# Altium schematic sheet Microcontroller_IO.SchDoc: Microcontroller IO Ports
size A4; DrawnBy: J. Wilson & M. Small; Revision: 1.0; SheetNumber: 2; SheetTotal: 10
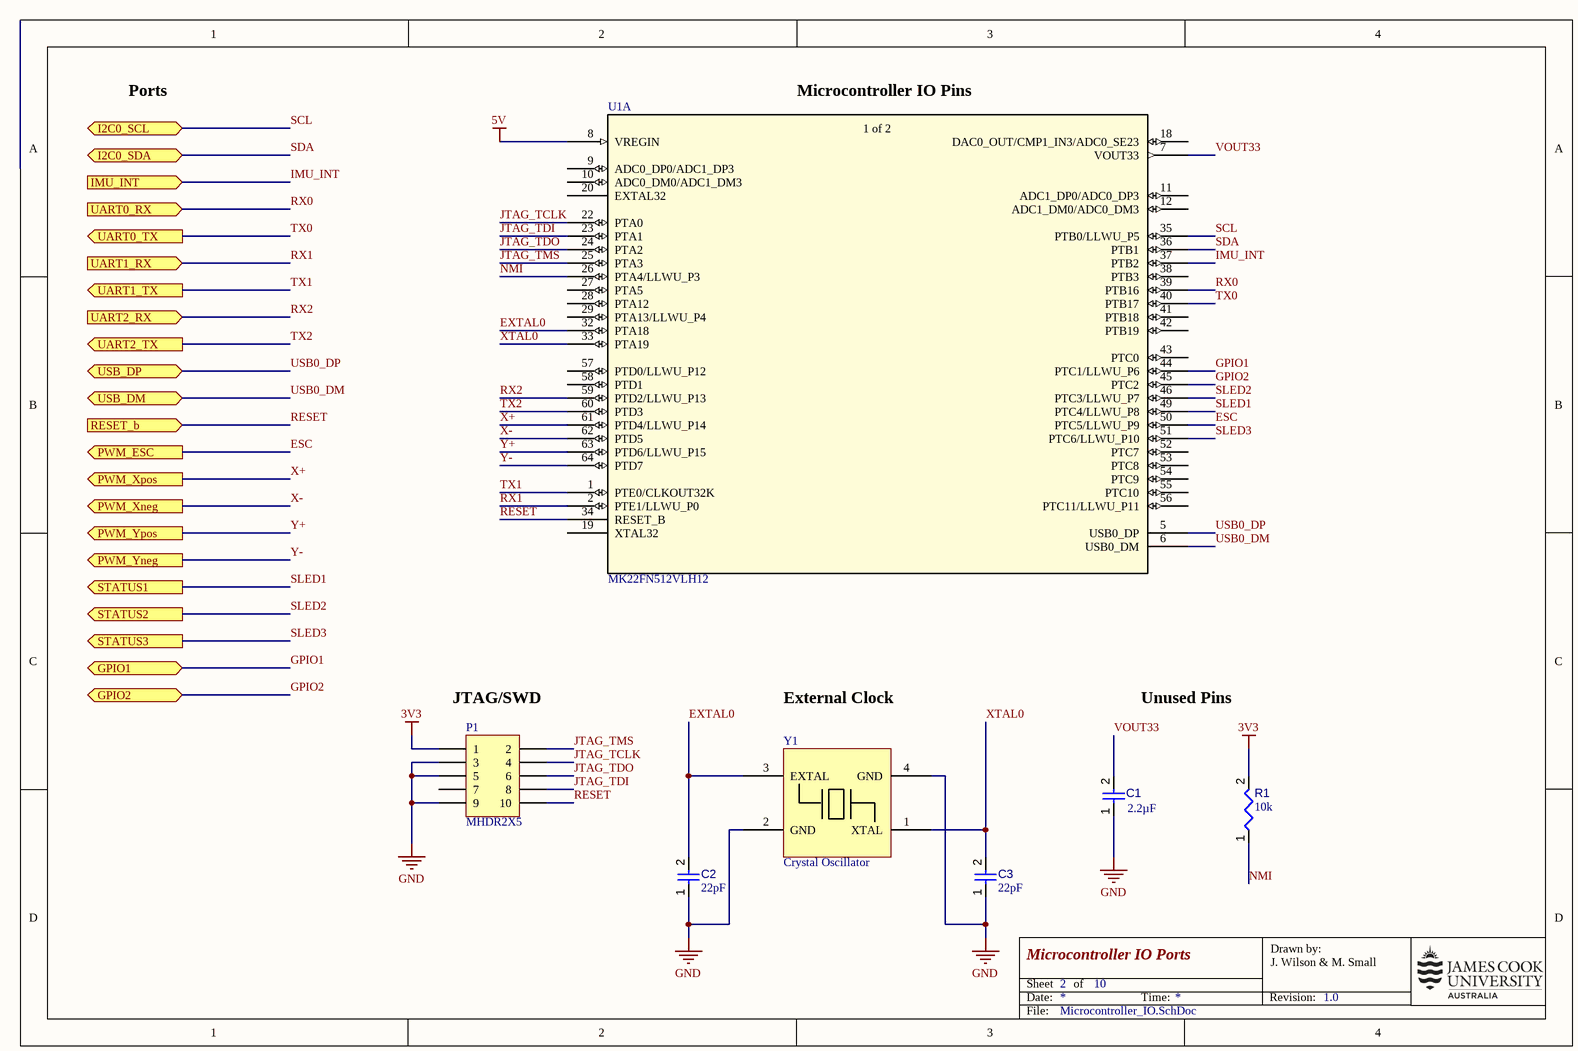
[diagram p0: Microcontroller_IO.SchDoc]

## Parts
C1  value 2.2µF  [CAPC0805(2012)145_L]  (hidden comment: Capacitor 2.2µF +/-20% 10V 0805)
C2  value 22pF  [CAPC0805(2012)145_L]  (hidden comment: Capacitor 22pF +/-5% 0805)
C3  value 22pF  [CAPC0805(2012)145_L]  (hidden comment: Capacitor 22pF +/-5% 0805)
P1  MHDR2X5  [JTAG 2x5 1.27mm]
R1  value 10k  [RESC0805(2012)_L]  (hidden comment: Resistor 10K +/-5% 0805 125 mW)
U1  MK22FN512VLH12  [LQFP-64_10X10X1.6_NXP]  (part A of 2)
Y1  Crystal Oscillator  [ABM3B]

## Ports
GPIO1 (bidir), GPIO2 (bidir), I2C0_SCL (bidir), I2C0_SDA (bidir), IMU_INT (in), PWM_ESC (out), PWM_Xneg (out), PWM_Xpos (out), PWM_Yneg (out), PWM_Ypos (out), RESET_b (in), STATUS1 (out), STATUS2 (out), STATUS3 (out), UART0_RX (in), UART0_TX (out), UART1_RX (in), UART1_TX (out), UART2_RX (in), UART2_TX (out), USB_DM (bidir), USB_DP (bidir)

## Nets
3V3: P1.1 R1.2
5V: U1.8(VREGIN)
GND: C1.1 C2.1 C3.1 P1.3 P1.5 P1.9 Y1.2(GND) Y1.4(GND)
ESC: U1.50(PTC5/LLWU_P9) ; port PWM_ESC
EXTAL0: C2.2 U1.32(PTA18) Y1.3(EXTAL)
GPIO1: U1.44(PTC1/LLWU_P6) ; port GPIO1
GPIO2: U1.45(PTC2) ; port GPIO2
IMU_INT: U1.37(PTB2) ; port IMU_INT
JTAG_TCLK: P1.4 U1.22(PTA0)
JTAG_TDI: P1.8 U1.23(PTA1)
JTAG_TDO: P1.6 U1.24(PTA2)
JTAG_TMS: P1.2 U1.25(PTA3)
NMI: R1.1 U1.26(PTA4/LLWU_P3)
RESET: P1.10 U1.34(RESET_B) ; port RESET_b
RX0: U1.39(PTB16) ; port UART0_RX
RX1: U1.2(PTE1/LLWU_P0) ; port UART1_RX
RX2: U1.59(PTD2/LLWU_P13) ; port UART2_RX
SCL: U1.35(PTB0/LLWU_P5) ; port I2C0_SCL
SDA: U1.36(PTB1) ; port I2C0_SDA
SLED1: U1.49(PTC4/LLWU_P8) ; port STATUS1
SLED2: U1.46(PTC3/LLWU_P7) ; port STATUS2
SLED3: U1.51(PTC6/LLWU_P10) ; port STATUS3
TX0: U1.40(PTB17) ; port UART0_TX
TX1: U1.1(PTE0/CLKOUT32K) ; port UART1_TX
TX2: U1.60(PTD3) ; port UART2_TX
USB0_DM: U1.6(USB0_DM) ; port USB_DM
USB0_DP: U1.5(USB0_DP) ; port USB_DP
VOUT33: C1.2 U1.7(VOUT33)
X+: U1.61(PTD4/LLWU_P14) ; port PWM_Xpos
X-: U1.62(PTD5) ; port PWM_Xneg
XTAL0: C3.2 U1.33(PTA19) Y1.1(XTAL)
Y+: U1.63(PTD6/LLWU_P15) ; port PWM_Ypos
Y-: U1.64(PTD7) ; port PWM_Yneg

Not connected (* = marked no-connect by the designer): P1 7; U1 9(ADC0_DP0/ADC1_DP3) 10(ADC0_DM0/ADC1_DM3) 11(ADC1_DP0/ADC0_DP3) 12(ADC1_DM0/ADC0_DM3) 18(DAC0_OUT/CMP1_IN3/ADC0_SE23) 19(XTAL32) 20(EXTAL32) 27(PTA5) 28(PTA12) 29(PTA13/LLWU_P4) 38(PTB3) 41(PTB18) 42(PTB19) 43(PTC0) 52(PTC7) 53(PTC8) 54(PTC9) 55(PTC10) 56(PTC11/LLWU_P11) 57(PTD0/LLWU_P12) 58(PTD1)

## Notes on the sheet
- Ports
- (near U1) Microcontroller IO Pins
- (near P1) JTAG/SWD
- External Clock
- Unused Pins
- Date:
- Sheet
- of
- Time:
- Revision:
- Drawn by:
- File:
- (in symbol MK22FN512VLH12, part A) 1 of 2

## Library data of the parts
C1 = CMP-001-00079-2: Chip Capacitor, 2.2µF +/-20%, 10V, 0805, Thickness 1.45 mm; Tolerance: 10%; Pins: 2; Max Operating Temperature: 85°C; Mounting Technology: SMT; Case/Package: 0805; Voltage Rating: 10V; Min Operating Temperature: -55°C
C2 C3 = CMP-001-00081-2: Chip Capacitor, 22pF +/- 5%, 0805, Thickness 1.45 mm; Voltage Rating: 16V; Min Operating Temperature: -55°C; Tolerance: 5%; Mounting Technology: SMT; Case/Package: 0402; Pins: 2; Max Operating Temperature: 85°C
P1 = MHDR2X5: Header, 5-Pin, Dual row; LatestRevisionDate: 17-Jul-2002; LatestRevisionNote: Re-released for DXP Platform.; Publisher: Altium Limited
R1 = CMP-009-00118-2: Chip Resistor, 10 kOhms, +/-5%, 125 mW, -55 to 155 degC, 0805; Power: 125mW; Tolerance: 5%; Max Operating Temperature: 155°C; Min Operating Temperature: -55°C; Pins: 2; Case/Package: 0805
U1 = MK22FN512VLH12: No Description Available; SourceLibrary: NXP_2015-03-30; Pin_Count: 64; SRAM_KB: 128; Flash_KB: 512; Max_Frequency: 120; CPU: ARM Cortex-M4F; Vendor: NXP; Copyright: Copyright (C) 2016 Accelerated Designs. All rights reserved; Package: LQFP; Manufacturer_Part_Number: MK22FN512VLH12; RefDes: RefDes; Type: DEV
Y1 = Crystal Oscillator: Abracon  ABM3B Oscillator